# EAGLE schematic circuit (EAGLE 9.6.2)
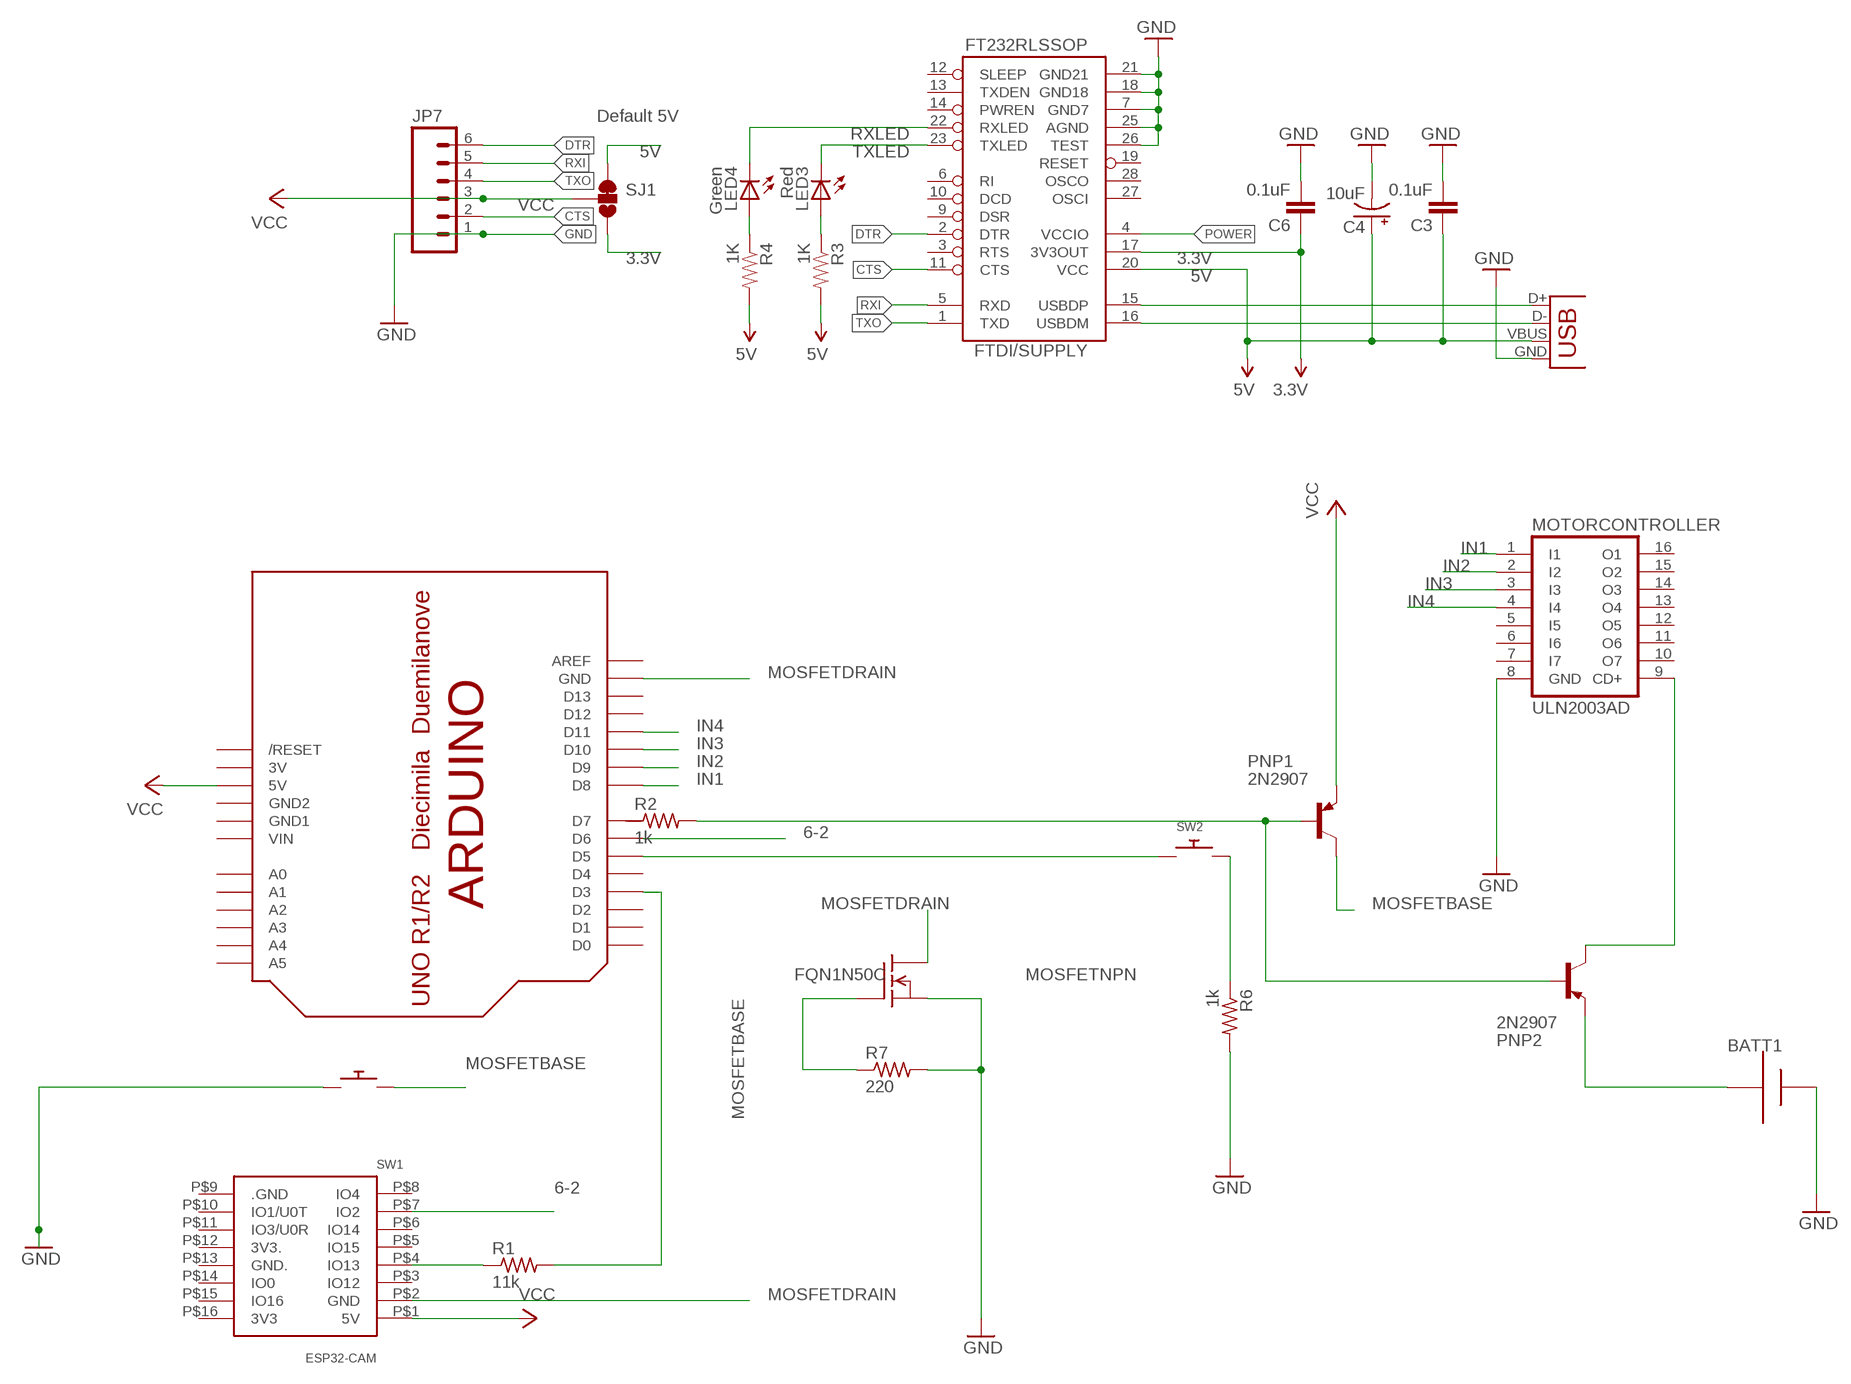
[diagram p0: schematic, sheet 1]

## Parts
BATT1  AAA  [12BH412]
C3  0.1uF  CAP0603-CAP  [0603-CAP]
C4  10uF  CAP_POL1206  [EIA3216]
C6  0.1uF  CAP0603-CAP  [0603-CAP]
ESP32-CAM  ESP32-CAM  [ESP32-CAM]
FTDI/SUPPLY  FT232RLSSOP  [SSOP28DB]
JP7  M06SMD-FEMALE-V2  [1X06-SMD-FEMALE-V2]
LED3  Red  LED0603  [LED-0603]
LED4  Green  LED0603  [LED-0603]
MOSFETNPN  FQN1N50C  [TO92]
MOTORCONTROLLER  ULN2003AD  [SO16]
PNP1  2N2907  [TO92-EBC-OVAL]
PNP2  2N2907  [TO92-EBC-OVAL]
R1  11k  R-US_0204/2V  [0204V]
R2  1k  FLIPFLOP-RES  [0805-THM]
R3  1K  RESISTOR0603-RES  [0603-RES]
R4  1K  RESISTOR0603-RES  [0603-RES]
R6  1k  FLIPFLOP-RES  [0805-THM]
R7  220  FLIPFLOP-RES  [0805-THM]
SJ1  SOLDERJUMPER_2WAYS  [SJ_3]
SW1  SWITCH_PUSHBUTTONSOFTTOUCHSMD_SJ  [PUSHBUTTON_SMD_SJ]
SW2  SWITCH_PUSHBUTTONSOFTTOUCHSMD_SJ  [PUSHBUTTON_SMD_SJ]
U$2  ARDUINOUNO  [ARDUINO]
X1  USB-SMD-NS  [USB-MINIB-NOSTOP]

## Nets
3.3V [power]: C6.1 FTDI/SUPPLY.17(3V3OUT) SJ1.3
5V: C3.1 C4.A(+) FTDI/SUPPLY.20(VCC) R3.2 R4.2 SJ1.1 X1.VBUS
6-2: ESP32-CAM.P$7(IO2) U$2.D6
CTS: FTDI/SUPPLY.11(CTS) JP7.2
DTR: FTDI/SUPPLY.2(DTR) JP7.6
GND [power]: BATT1.+ C3.2 C4.C(-) C6.2 FTDI/SUPPLY.7(GND7) FTDI/SUPPLY.18(GND18) FTDI/SUPPLY.21(GND21) FTDI/SUPPLY.25(AGND) FTDI/SUPPLY.26(TEST) JP7.1 MOSFETNPN.3(S) MOTORCONTROLLER.8(GND) R6.2 R7.2 SW1.P$1 X1.GND
IN1: MOTORCONTROLLER.1(I1) U$2.D8
IN2: MOTORCONTROLLER.2(I2) U$2.D9
IN3: MOTORCONTROLLER.3(I3) U$2.D10
IN4: MOTORCONTROLLER.4(I4) U$2.D11
MOSFETBASE: MOSFETNPN.1(G) PNP1.C R7.1 SW1.P$2
MOSFETDRAIN [power]: ESP32-CAM.P$2(GND) MOSFETNPN.2(D) U$2.GND
N$1: R1.2 U$2.D3
N$2: ESP32-CAM.P$4(IO13) R1.1
N$3: LED3.A R3.1
N$4: LED4.A R4.1
N$6: PNP1.B PNP2.B R2.2
N$7: MOTORCONTROLLER.9(CD+) PNP2.C
N$12: BATT1.- PNP2.E
N$13: SW2.P$1 U$2.D5
N$15 [power]: R6.1 SW2.P$2
POWER: FTDI/SUPPLY.4(VCCIO)
RXI: FTDI/SUPPLY.5(RXD) JP7.5
RXLED: FTDI/SUPPLY.22(RXLED) LED4.C
TXLED: FTDI/SUPPLY.23(TXLED) LED3.C
TXO: FTDI/SUPPLY.1(TXD) JP7.4
USB_D+1: FTDI/SUPPLY.15(USBDP) X1.D+
USB_D-1: FTDI/SUPPLY.16(USBDM) X1.D-
VCC: ESP32-CAM.P$1(5V) JP7.3 PNP1.E SJ1.2 U$2.5V
Unconnected: ESP32-CAM.P$3(IO12) ESP32-CAM.P$5(IO15) ESP32-CAM.P$6(IO14) ESP32-CAM.P$8(IO4) ESP32-CAM.P$9(.GND) ESP32-CAM.P$10(IO1/U0T) ESP32-CAM.P$11(IO3/U0R) ESP32-CAM.P$12(3V3.) ESP32-CAM.P$13(GND.) ESP32-CAM.P$14(IO0) ESP32-CAM.P$15(IO16) ESP32-CAM.P$16(3V3) FTDI/SUPPLY.3(RTS) FTDI/SUPPLY.6(RI) FTDI/SUPPLY.9(DSR) FTDI/SUPPLY.10(DCD) FTDI/SUPPLY.12(SLEEP) FTDI/SUPPLY.13(TXDEN) FTDI/SUPPLY.14(PWREN) FTDI/SUPPLY.19(RESET) FTDI/SUPPLY.27(OSCI) FTDI/SUPPLY.28(OSCO) MOTORCONTROLLER.5(I5) MOTORCONTROLLER.6(I6) MOTORCONTROLLER.7(I7) MOTORCONTROLLER.10(O7) MOTORCONTROLLER.11(O6) MOTORCONTROLLER.12(O5) MOTORCONTROLLER.13(O4) MOTORCONTROLLER.14(O3) MOTORCONTROLLER.15(O2) MOTORCONTROLLER.16(O1) R2.1 U$2.A0 U$2.A1 U$2.A2 U$2.A3 U$2.A4 U$2.A5 U$2.AREF U$2.D0 U$2.D1 U$2.D2 U$2.D4 U$2.D7 U$2.D12 U$2.D13 U$2.RESET(/RESET)

## Notes on the sheet
- Default 5V

## Power pins joined to a net without a drawn wire
3V: U$2.3V
GND1: U$2.GND1
GND2: U$2.GND2
VIN: U$2.VIN

## Library data of the parts
BATT1 = adafruit:AAA: AAA PC pin holder Mouser part #12BH412 - but pretty much any 1x AAA battery holder should be the same http://www.ladyada.net/library/pcb/eaglelibrary.html
C3 C6 = SparkFun:CAP: Capacitor Standard 0603 ceramic capacitor, and 0.1" leaded capacitor.
C4 = SparkFun:CAP_POL: Capacitor Polarized These are standard SMD and PTH capacitors. Normally 10uF, 47uF, and 100uF in electrolytic and tantalum varieties. Always verify the external diameter of the through hole cap, it varies with capacity, voltage, and manufacturer. The EIA devices should be standard.
ESP32-CAM = ESP32-CAM:ESP32-CAM: Check availability <https://pricing.snapeda.com/parts/ESP32-CAM/AI-Thinker/view-part?ref=eda>; AVAILABILITY: Not in stock; DESCRIPTION: ESP32 ESP32 Transceiver; 802.11 a/b/g/n (Wi-Fi, WiFi, WLAN), Bluetooth® Smart 4.x Low Energy (BLE) Evaluation Board; MF: AI-Thinker; MP: ESP32-CAM; PACKAGE: None; PRICE: None
FTDI/SUPPLY = SparkFun:FT232RL: USB UART FT232RL 4th Generation USB UART (USB <-> Serial) Controller. Spark Fun Electronics SKU : COM-00650
JP7 = SparkFun:M06: Header 6 Standard 6-pin 0.1" header. Use with straight break away headers (SKU : PRT-00116), right angle break away headers (PRT-00553), swiss pins (PRT-00743), machine pins (PRT-00117), and female headers (PRT-00115). Molex polarized connector foot print use with SKU : PRT-08094 with associated crimp pins and housings. NOTES ON THE VARIANTS LOCK and LOCK_LONGPADS... This footprint was designed to help hold the alignment of a through-hole component (i.e. 6-pin header) while soldering it into place. You may notice that each hole has been shifted either up or down by 0.005 of an inch from it's more standard position (which is a perfectly straight line). This slight alteration caused the pins (the squares in the middle) to touch the edges of the holes. Because they are alternating, it causes a "brace" to hold the component in place. 0.005 has proven to be the perfect amount of "off-center" position when using our standard breakaway headers. Although looks a little odd when you look at the bare footprint, once you have a header in there, the alteration is very hard to notice. Also, if you push a header all the way into place, it is covered up entirely on the bottom side. This idea of altering the position of holes to aid alignment will be further integrated into the Sparkfun Library for other footprints. It can help hold any component with 3 or more connection pins.
LED3 LED4 = SparkFun:LED: LEDs Standard schematic elements and footprints for 5mm, 3mm, 1206, and 0603 sized LEDs. 5mm - Spark Fun Electronics SKU : COM-00529 (and others)
MOSFETNPN = adafruit:FQN1N50C: N-Channel Enhancement MOSFET 500V, 0.4A, 6.0 Ohm
MOTORCONTROLLER = uln-udn:ULN2003A: DRIVER ARRAY
PNP1 PNP2 = adafruit:2N2907*: PNP Transistor Big Oval pads
R1 = rcl:R-US_: RESISTOR, American symbol; SPICEPREFIX: R
R2 R6 R7 = adafruit:FLIPFLOP-RES: Flip Flop resistor An 0805 resistor inside a standard 1/4W 5% resistor. Makes for easy mods
R3 R4 = SparkFun:RESISTOR: Resistor Basic schematic elements and footprints for 0603, 1206, and PTH resistors.
SJ1 = SparkFun:SOLDERJUMPER_2WAY: Solder Jumper 2 way solder jumper
SW1 SW2 = adafruit:SWITCH_PUSHBUTTON: Buttons SOFTTOUCHSMD_SJ - Soft touch temporary push button (Super Junk Akihabara) Compatible with SKPMANE010 [Mouser: 688-SKPMAN] C&K_KSS = Digikey: KSS221GLFS
U$2 = adafruit:ARDUINO: Arduino Diecimila/Duemilanove Make a shield with ease, this package has all the named pins as well as the two mounting drill holes and an outline of the USB and DC power connector. The outline is on the DIMENSION layer, so if your board house uses it they will cut the outline to match. http://www.ladyada.net/library/pcb/eaglelibrary.html
X1 = SparkFun:USB: USB Connectors USB-B-PTH is fully proven SKU : PRT-00139 USB-miniB is fully proven SKU : PRT-00587 USB-A-PCB is untested. USB-A-H is throughly reviewed, but untested. Spark Fun Electronics SKU : PRT-00437 USB-B-SMT is throughly reviewed, but untested. Needs silkscreen touching up. USB-A-S has not been used/tested USB-MB-H has not been used/tested

## Net classes
0 default: width 0.203 mm
1 power: width 0.254 mm